# Altium schematic sheet Analog_HC_Overcurrent_MMPQ3904.SchDoc
size A
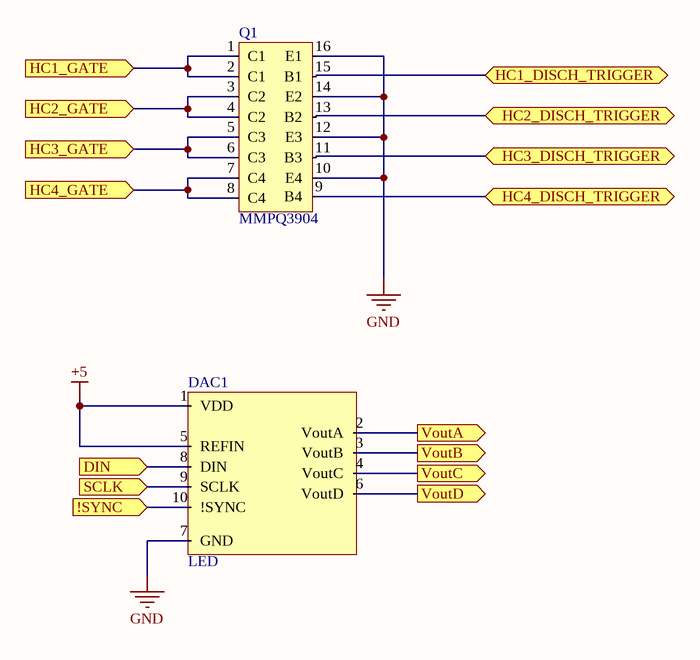
[diagram p0: Analog_HC_Overcurrent_MMPQ3904.SchDoc]

## Parts
DAC1  LED  [MSOP10 (RM-10)]
Q1  MMPQ3904  [SOIC-16-NB]

## Ports
!SYNC (in), DIN (in), HC1_DISCH_TRIGGER (bidir), HC1_GATE (in), HC2_DISCH_TRIGGER (bidir), HC2_GATE (in), HC3_DISCH_TRIGGER (bidir), HC3_GATE (in), HC4_DISCH_TRIGGER (bidir), HC4_GATE (in), SCLK (in), VoutA (out), VoutB (out), VoutC (out), VoutD (out)

## Nets
+5: DAC1.1(VDD) DAC1.5(REFIN)
GND: DAC1.7(GND) Q1.10(E4) Q1.12(E3) Q1.14(E2) Q1.16(E1)
!SYNC: DAC1.10(!SYNC) ; port !SYNC
DIN: DAC1.8(DIN) ; port DIN
HC1_DISCH_TRIGGER: Q1.15(B1) ; port HC1_DISCH_TRIGGER
HC1_GATE: Q1.1(C1) Q1.2(C1) ; port HC1_GATE
HC2_DISCH_TRIGGER: Q1.13(B2) ; port HC2_DISCH_TRIGGER
HC2_GATE: Q1.3(C2) Q1.4(C2) ; port HC2_GATE
HC3_DISCH_TRIGGER: Q1.11(B3) ; port HC3_DISCH_TRIGGER
HC3_GATE: Q1.5(C3) Q1.6(C3) ; port HC3_GATE
HC4_DISCH_TRIGGER: Q1.9(B4) ; port HC4_DISCH_TRIGGER
HC4_GATE: Q1.7(C4) Q1.8(C4) ; port HC4_GATE
SCLK: DAC1.9(SCLK) ; port SCLK
VoutA: DAC1.2(VoutA) ; port VoutA
VoutB: DAC1.3(VoutB) ; port VoutB
VoutC: DAC1.4(VoutC) ; port VoutC
VoutD: DAC1.6(VoutD) ; port VoutD

## Library data of the parts
DAC1 = 25: 10bit 4 channel DAC; Manufacturer_id: 1; idFuse: 3; idIC_Misc: 25; Num_Circuits: 4; Vin(Min): 2.5; Vin(Max): 5.5; Drawer_id: 1; Name: AD5314ARMZ; Value: 10bit; Type: DAC; Package: MSOP-10; MfrPartNo: AD5314ARMZ; Link: https://www.digikey.com/product-detail/en/analog-devices-inc/AD5314ARMZ/AD5314ARMZ-ND/653841
Q1 = 5: Manufacturer_id: 1; idBJT: 5; Type: NPN Array; Num_Circuits: 4; hFE: 75; Ic: 200mA; Vce(Max): 40V; Created_By: Angel Delgado; MfrPartNo: MMPQ3904; Drawer_id: 1; Name: MMPQ3904; Package: SOIC-16; Link: https://www.mouser.com/ProductDetail/ON-Semiconductor-Fairchild/MMPQ3904?qs=sGAEpiMZZMshyDBzk1%2fWi8oN7VHZ91OkACYhS8H8agM%3d